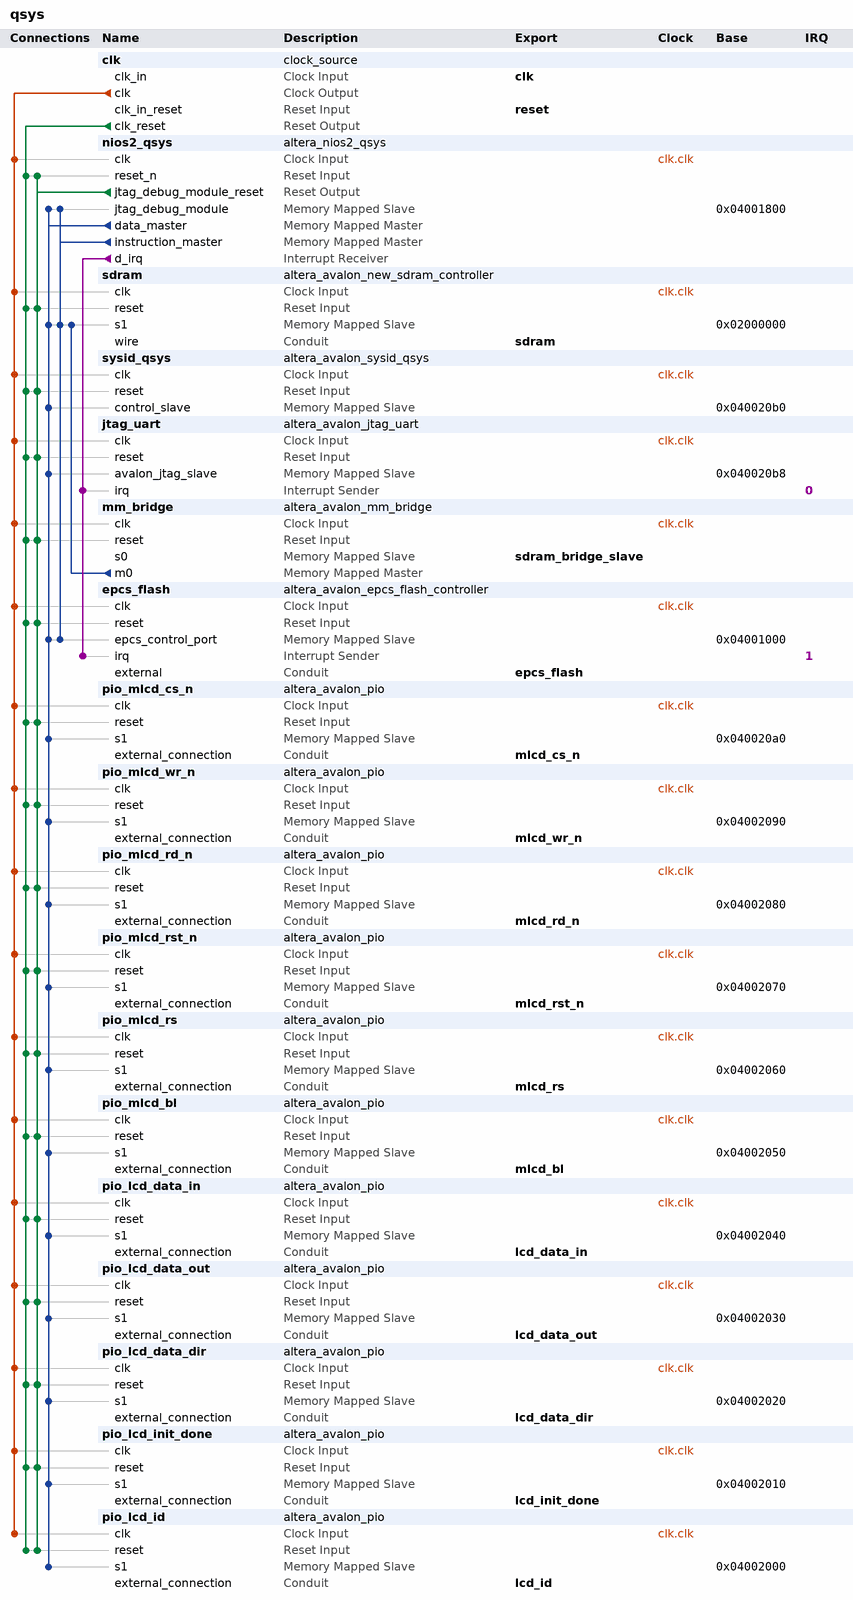
[diagram p0: system contents]
# Platform Designer (Qsys) system qsys, Cyclone IV E EP4CE10F17C8
# Parameters at their usual value, and those the tool derives, are not listed.
package require -exact qsys 13.1
create_system qsys
set_project_property DEVICE_FAMILY {Cyclone IV E}
set_project_property DEVICE EP4CE10F17C8

add_instance clk clock_source 13.1
set_instance_parameter_value clk clockFrequency 100000000

add_instance nios2_qsys altera_nios2_qsys 13.1
set_instance_parameter_value nios2_qsys resetSlave epcs_flash.epcs_control_port
set_instance_parameter_value nios2_qsys mmu_TLBMissExcSlave None
set_instance_parameter_value nios2_qsys exceptionSlave sdram.s1
set_instance_parameter_value nios2_qsys breakSlave nios2_qsys.jtag_debug_module
set_instance_parameter_value nios2_qsys impl Fast
set_instance_parameter_value nios2_qsys icache_size 4096

add_instance sdram altera_avalon_new_sdram_controller 13.1
set_instance_parameter_value sdram TAC 5.4
set_instance_parameter_value sdram TRCD 20.0
set_instance_parameter_value sdram TRFC 64.0
set_instance_parameter_value sdram TRP 20.0
set_instance_parameter_value sdram TWR 20.0
set_instance_parameter_value sdram casLatency 3
set_instance_parameter_value sdram columnWidth 9
set_instance_parameter_value sdram dataWidth 16
set_instance_parameter_value sdram generateSimulationModel false
set_instance_parameter_value sdram initRefreshCommands 8
set_instance_parameter_value sdram model single_Micron_MT48LC4M32B2_7_chip
set_instance_parameter_value sdram numberOfBanks 4
set_instance_parameter_value sdram numberOfChipSelects 1
set_instance_parameter_value sdram powerUpDelay 200.0
set_instance_parameter_value sdram refreshPeriod 7.8125
set_instance_parameter_value sdram rowWidth 13

add_instance sysid_qsys altera_avalon_sysid_qsys 13.1
set_instance_parameter_value sysid_qsys id 0

add_instance jtag_uart altera_avalon_jtag_uart 13.1
set_instance_parameter_value jtag_uart simInteractiveOptions NO_INTERACTIVE_WINDOWS

add_instance mm_bridge altera_avalon_mm_bridge 13.1
set_instance_parameter_value mm_bridge DATA_WIDTH 16
set_instance_parameter_value mm_bridge ADDRESS_WIDTH 26
set_instance_parameter_value mm_bridge ADDRESS_UNITS SYMBOLS
set_instance_parameter_value mm_bridge MAX_BURST_SIZE 512
set_instance_parameter_value mm_bridge MAX_PENDING_RESPONSES 4

add_instance epcs_flash altera_avalon_epcs_flash_controller 13.1

add_instance pio_mlcd_cs_n altera_avalon_pio 13.1
set_instance_parameter_value pio_mlcd_cs_n direction Output
set_instance_parameter_value pio_mlcd_cs_n width 1

add_instance pio_mlcd_wr_n altera_avalon_pio 13.1
set_instance_parameter_value pio_mlcd_wr_n direction Output
set_instance_parameter_value pio_mlcd_wr_n width 1

add_instance pio_mlcd_rd_n altera_avalon_pio 13.1
set_instance_parameter_value pio_mlcd_rd_n direction Output
set_instance_parameter_value pio_mlcd_rd_n width 1

add_instance pio_mlcd_rst_n altera_avalon_pio 13.1
set_instance_parameter_value pio_mlcd_rst_n direction Output
set_instance_parameter_value pio_mlcd_rst_n width 1

add_instance pio_mlcd_rs altera_avalon_pio 13.1
set_instance_parameter_value pio_mlcd_rs direction Output
set_instance_parameter_value pio_mlcd_rs width 1

add_instance pio_mlcd_bl altera_avalon_pio 13.1
set_instance_parameter_value pio_mlcd_bl direction Output
set_instance_parameter_value pio_mlcd_bl width 1

add_instance pio_lcd_data_in altera_avalon_pio 13.1
set_instance_parameter_value pio_lcd_data_in direction Input
set_instance_parameter_value pio_lcd_data_in width 16

add_instance pio_lcd_data_out altera_avalon_pio 13.1
set_instance_parameter_value pio_lcd_data_out direction Output
set_instance_parameter_value pio_lcd_data_out width 16

add_instance pio_lcd_data_dir altera_avalon_pio 13.1
set_instance_parameter_value pio_lcd_data_dir direction Output
set_instance_parameter_value pio_lcd_data_dir width 1

add_instance pio_lcd_init_done altera_avalon_pio 13.1
set_instance_parameter_value pio_lcd_init_done direction Output
set_instance_parameter_value pio_lcd_init_done width 1

add_instance pio_lcd_id altera_avalon_pio 13.1
set_instance_parameter_value pio_lcd_id direction Output
set_instance_parameter_value pio_lcd_id width 16

# connections
add_connection clk.clk epcs_flash.clk clock
add_connection clk.clk jtag_uart.clk clock
add_connection clk.clk mm_bridge.clk clock
add_connection clk.clk nios2_qsys.clk clock
add_connection clk.clk pio_lcd_data_dir.clk clock
add_connection clk.clk pio_lcd_data_in.clk clock
add_connection clk.clk pio_lcd_data_out.clk clock
add_connection clk.clk pio_lcd_id.clk clock
add_connection clk.clk pio_lcd_init_done.clk clock
add_connection clk.clk pio_mlcd_bl.clk clock
add_connection clk.clk pio_mlcd_cs_n.clk clock
add_connection clk.clk pio_mlcd_rd_n.clk clock
add_connection clk.clk pio_mlcd_rs.clk clock
add_connection clk.clk pio_mlcd_rst_n.clk clock
add_connection clk.clk pio_mlcd_wr_n.clk clock
add_connection clk.clk sdram.clk clock
add_connection clk.clk sysid_qsys.clk clock
add_connection clk.clk_reset epcs_flash.reset reset
add_connection clk.clk_reset jtag_uart.reset reset
add_connection clk.clk_reset mm_bridge.reset reset
add_connection clk.clk_reset nios2_qsys.reset_n reset
add_connection clk.clk_reset pio_lcd_data_dir.reset reset
add_connection clk.clk_reset pio_lcd_data_in.reset reset
add_connection clk.clk_reset pio_lcd_data_out.reset reset
add_connection clk.clk_reset pio_lcd_id.reset reset
add_connection clk.clk_reset pio_lcd_init_done.reset reset
add_connection clk.clk_reset pio_mlcd_bl.reset reset
add_connection clk.clk_reset pio_mlcd_cs_n.reset reset
add_connection clk.clk_reset pio_mlcd_rd_n.reset reset
add_connection clk.clk_reset pio_mlcd_rs.reset reset
add_connection clk.clk_reset pio_mlcd_rst_n.reset reset
add_connection clk.clk_reset pio_mlcd_wr_n.reset reset
add_connection clk.clk_reset sdram.reset reset
add_connection clk.clk_reset sysid_qsys.reset reset
add_connection nios2_qsys.jtag_debug_module_reset epcs_flash.reset reset
add_connection nios2_qsys.jtag_debug_module_reset jtag_uart.reset reset
add_connection nios2_qsys.jtag_debug_module_reset mm_bridge.reset reset
add_connection nios2_qsys.jtag_debug_module_reset nios2_qsys.reset_n reset
add_connection nios2_qsys.jtag_debug_module_reset pio_lcd_data_dir.reset reset
add_connection nios2_qsys.jtag_debug_module_reset pio_lcd_data_in.reset reset
add_connection nios2_qsys.jtag_debug_module_reset pio_lcd_data_out.reset reset
add_connection nios2_qsys.jtag_debug_module_reset pio_lcd_id.reset reset
add_connection nios2_qsys.jtag_debug_module_reset pio_lcd_init_done.reset reset
add_connection nios2_qsys.jtag_debug_module_reset pio_mlcd_bl.reset reset
add_connection nios2_qsys.jtag_debug_module_reset pio_mlcd_cs_n.reset reset
add_connection nios2_qsys.jtag_debug_module_reset pio_mlcd_rd_n.reset reset
add_connection nios2_qsys.jtag_debug_module_reset pio_mlcd_rs.reset reset
add_connection nios2_qsys.jtag_debug_module_reset pio_mlcd_rst_n.reset reset
add_connection nios2_qsys.jtag_debug_module_reset pio_mlcd_wr_n.reset reset
add_connection nios2_qsys.jtag_debug_module_reset sdram.reset reset
add_connection nios2_qsys.jtag_debug_module_reset sysid_qsys.reset reset
add_connection mm_bridge.m0 sdram.s1 avalon
set_connection_parameter_value mm_bridge.m0/sdram.s1 baseAddress 0x02000000
add_connection nios2_qsys.data_master epcs_flash.epcs_control_port avalon
set_connection_parameter_value nios2_qsys.data_master/epcs_flash.epcs_control_port baseAddress 0x04001000
add_connection nios2_qsys.data_master jtag_uart.avalon_jtag_slave avalon
set_connection_parameter_value nios2_qsys.data_master/jtag_uart.avalon_jtag_slave baseAddress 0x040020b8
add_connection nios2_qsys.data_master nios2_qsys.jtag_debug_module avalon
set_connection_parameter_value nios2_qsys.data_master/nios2_qsys.jtag_debug_module baseAddress 0x04001800
add_connection nios2_qsys.data_master pio_lcd_data_dir.s1 avalon
set_connection_parameter_value nios2_qsys.data_master/pio_lcd_data_dir.s1 baseAddress 0x04002020
add_connection nios2_qsys.data_master pio_lcd_data_in.s1 avalon
set_connection_parameter_value nios2_qsys.data_master/pio_lcd_data_in.s1 baseAddress 0x04002040
add_connection nios2_qsys.data_master pio_lcd_data_out.s1 avalon
set_connection_parameter_value nios2_qsys.data_master/pio_lcd_data_out.s1 baseAddress 0x04002030
add_connection nios2_qsys.data_master pio_lcd_id.s1 avalon
set_connection_parameter_value nios2_qsys.data_master/pio_lcd_id.s1 baseAddress 0x04002000
add_connection nios2_qsys.data_master pio_lcd_init_done.s1 avalon
set_connection_parameter_value nios2_qsys.data_master/pio_lcd_init_done.s1 baseAddress 0x04002010
add_connection nios2_qsys.data_master pio_mlcd_bl.s1 avalon
set_connection_parameter_value nios2_qsys.data_master/pio_mlcd_bl.s1 baseAddress 0x04002050
add_connection nios2_qsys.data_master pio_mlcd_cs_n.s1 avalon
set_connection_parameter_value nios2_qsys.data_master/pio_mlcd_cs_n.s1 baseAddress 0x040020a0
add_connection nios2_qsys.data_master pio_mlcd_rd_n.s1 avalon
set_connection_parameter_value nios2_qsys.data_master/pio_mlcd_rd_n.s1 baseAddress 0x04002080
add_connection nios2_qsys.data_master pio_mlcd_rs.s1 avalon
set_connection_parameter_value nios2_qsys.data_master/pio_mlcd_rs.s1 baseAddress 0x04002060
add_connection nios2_qsys.data_master pio_mlcd_rst_n.s1 avalon
set_connection_parameter_value nios2_qsys.data_master/pio_mlcd_rst_n.s1 baseAddress 0x04002070
add_connection nios2_qsys.data_master pio_mlcd_wr_n.s1 avalon
set_connection_parameter_value nios2_qsys.data_master/pio_mlcd_wr_n.s1 baseAddress 0x04002090
add_connection nios2_qsys.data_master sdram.s1 avalon
set_connection_parameter_value nios2_qsys.data_master/sdram.s1 baseAddress 0x02000000
add_connection nios2_qsys.data_master sysid_qsys.control_slave avalon
set_connection_parameter_value nios2_qsys.data_master/sysid_qsys.control_slave baseAddress 0x040020b0
add_connection nios2_qsys.instruction_master epcs_flash.epcs_control_port avalon
set_connection_parameter_value nios2_qsys.instruction_master/epcs_flash.epcs_control_port baseAddress 0x04001000
add_connection nios2_qsys.instruction_master nios2_qsys.jtag_debug_module avalon
set_connection_parameter_value nios2_qsys.instruction_master/nios2_qsys.jtag_debug_module baseAddress 0x04001800
add_connection nios2_qsys.instruction_master sdram.s1 avalon
set_connection_parameter_value nios2_qsys.instruction_master/sdram.s1 baseAddress 0x02000000
add_connection nios2_qsys.d_irq epcs_flash.irq interrupt
set_connection_parameter_value nios2_qsys.d_irq/epcs_flash.irq irqNumber 1
add_connection nios2_qsys.d_irq jtag_uart.irq interrupt
set_connection_parameter_value nios2_qsys.d_irq/jtag_uart.irq irqNumber 0

# exported interfaces
add_interface clk clock sink
set_interface_property clk EXPORT_OF clk.clk_in
add_interface reset reset sink
set_interface_property reset EXPORT_OF clk.clk_in_reset
add_interface sdram_bridge_slave avalon slave
set_interface_property sdram_bridge_slave EXPORT_OF mm_bridge.s0
add_interface sdram conduit end
set_interface_property sdram EXPORT_OF sdram.wire
add_interface epcs_flash conduit end
set_interface_property epcs_flash EXPORT_OF epcs_flash.external
add_interface lcd_id conduit end
set_interface_property lcd_id EXPORT_OF pio_lcd_id.external_connection
add_interface lcd_init_done conduit end
set_interface_property lcd_init_done EXPORT_OF pio_lcd_init_done.external_connection
add_interface lcd_data_dir conduit end
set_interface_property lcd_data_dir EXPORT_OF pio_lcd_data_dir.external_connection
add_interface lcd_data_out conduit end
set_interface_property lcd_data_out EXPORT_OF pio_lcd_data_out.external_connection
add_interface lcd_data_in conduit end
set_interface_property lcd_data_in EXPORT_OF pio_lcd_data_in.external_connection
add_interface mlcd_bl conduit end
set_interface_property mlcd_bl EXPORT_OF pio_mlcd_bl.external_connection
add_interface mlcd_rs conduit end
set_interface_property mlcd_rs EXPORT_OF pio_mlcd_rs.external_connection
add_interface mlcd_rst_n conduit end
set_interface_property mlcd_rst_n EXPORT_OF pio_mlcd_rst_n.external_connection
add_interface mlcd_rd_n conduit end
set_interface_property mlcd_rd_n EXPORT_OF pio_mlcd_rd_n.external_connection
add_interface mlcd_wr_n conduit end
set_interface_property mlcd_wr_n EXPORT_OF pio_mlcd_wr_n.external_connection
add_interface mlcd_cs_n conduit end
set_interface_property mlcd_cs_n EXPORT_OF pio_mlcd_cs_n.external_connection

set_interconnect_requirement {$system} qsys_mm.clockCrossingAdapter HANDSHAKE
set_interconnect_requirement {$system} qsys_mm.maxAdditionalLatency 1
set_interconnect_requirement {$system} qsys_mm.insertDefaultSlave false

save_system qsys.qsys
